# EAGLE design SAD_1_1 (EAGLE 8.3.2)
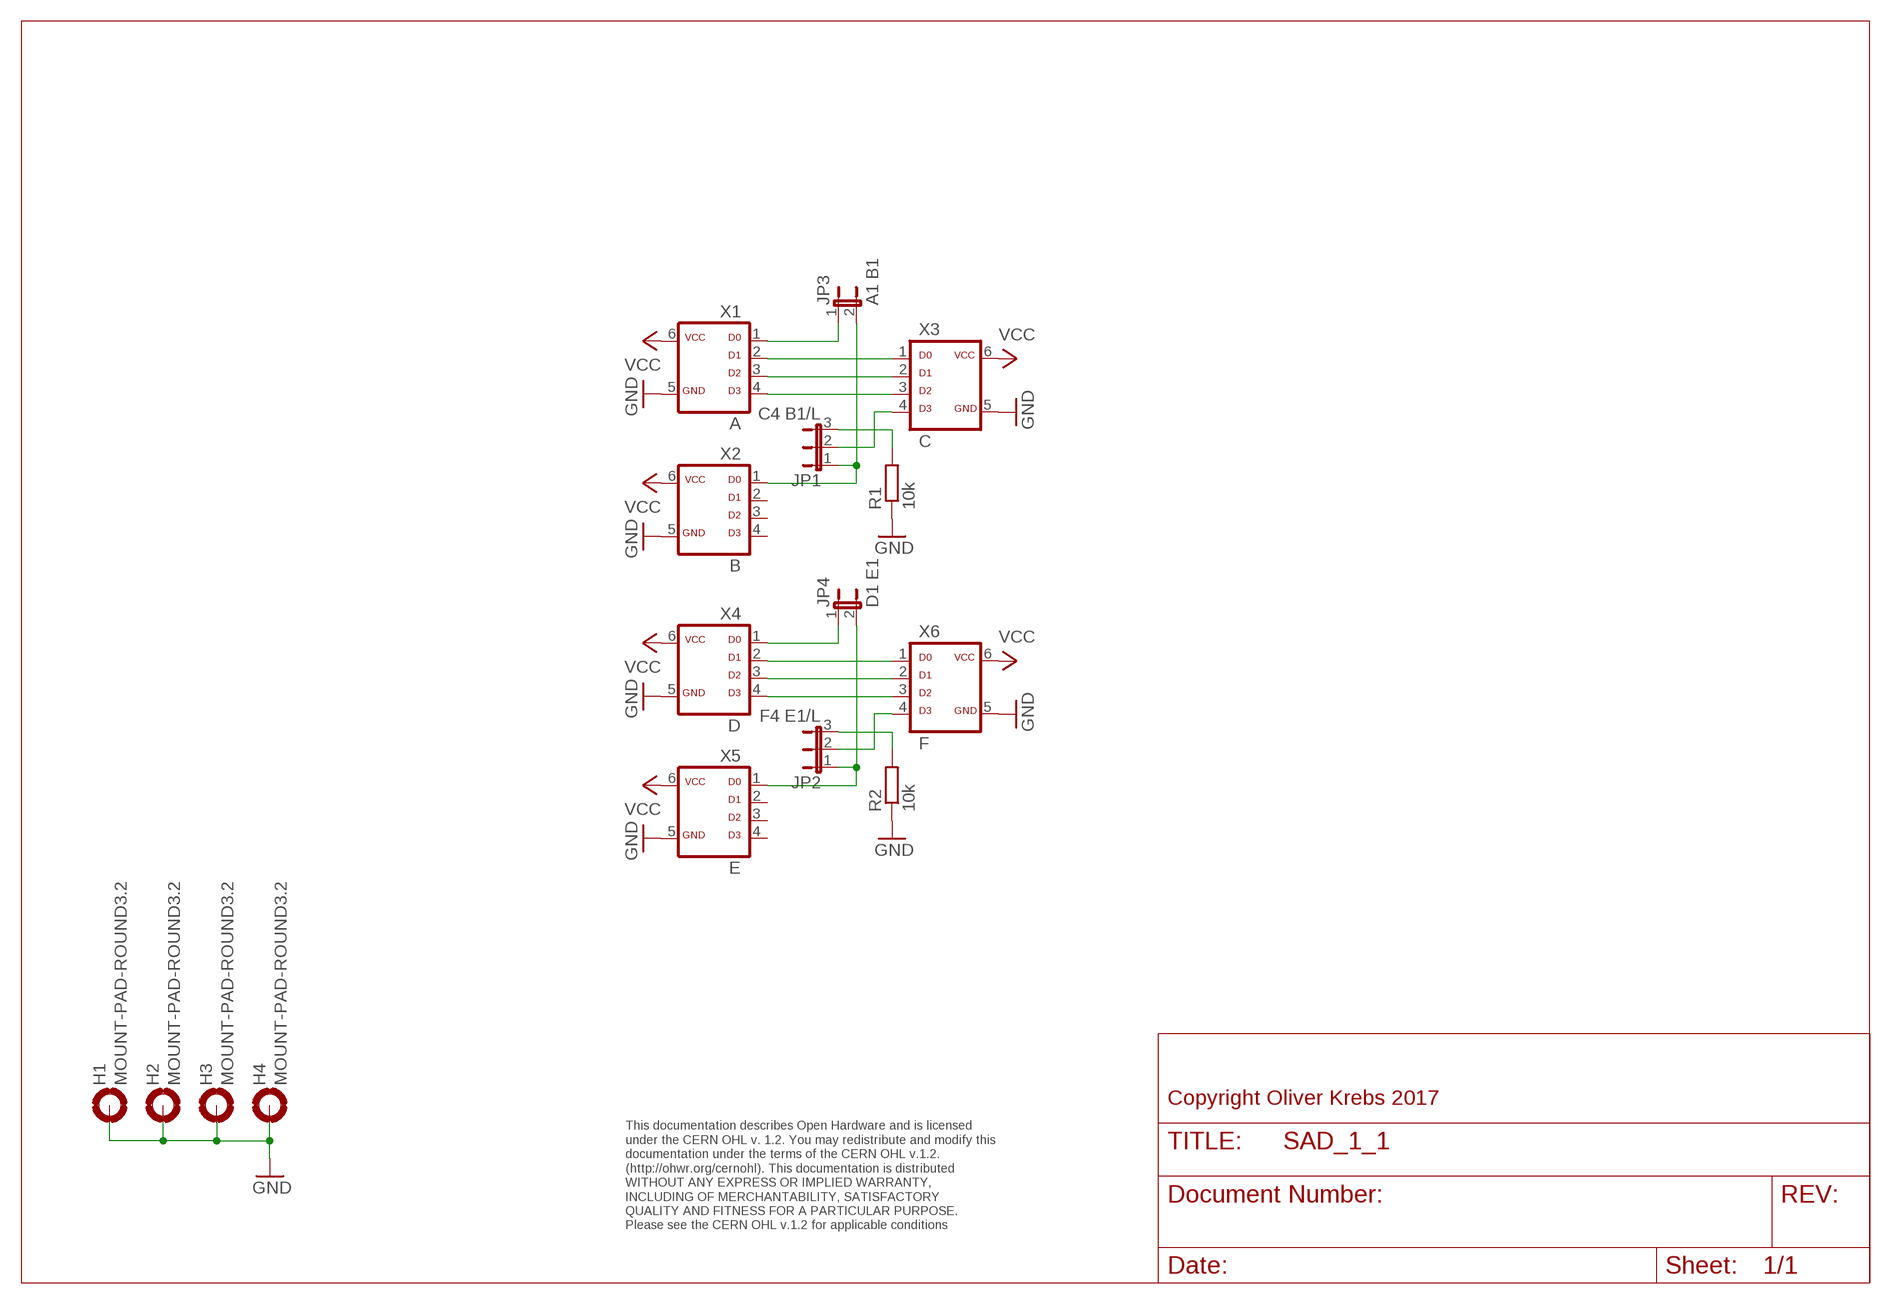
[diagram p0: schematic, sheet 1]

## Parts
H1  MOUNT-PAD-ROUND3.2  [3,2-PAD]
H2  MOUNT-PAD-ROUND3.2  [3,2-PAD]
H3  MOUNT-PAD-ROUND3.2  [3,2-PAD]
H4  MOUNT-PAD-ROUND3.2  [3,2-PAD]
JP1  C4 B1/L  JP2E  [JP2]
JP2  F4 E1/L  JP2E  [JP2]
JP3  A1 B1  JP1E  [JP1]
JP4  D1 E1  JP1E  [JP1]
R1  10k  R-EU_0207/10  [0207/10]
R2  10k  R-EU_0207/10  [0207/10]
X1  A  ML6D  [ML-6]
X2  B  ML6D  [ML-6]
X3  C  ML6D  [ML-6]
X4  D  ML6D  [ML-6]
X5  E  ML6D  [ML-6]
X6  F  ML6D  [ML-6]

## Nets
GND: H1.B3,2(MOUNT) H2.B3,2(MOUNT) H3.B3,2(MOUNT) H4.B3,2(MOUNT) R1.1 R2.1 X1.5 X2.5 X3.5 X4.5 X5.5 X6.5
N$1: X1.2 X3.1
N$2: X1.3 X3.2
N$3: X1.4 X3.3
N$4: JP1.2 X3.4
N$5: JP1.1 JP3.2 X2.1
N$6: JP4.1 X4.1
N$7: JP3.1 X1.1
N$8: JP1.3 R1.2
N$9: JP2.3 R2.2
N$10: X4.2 X6.1
N$11: X4.3 X6.2
N$12: X4.4 X6.3
N$13: JP2.2 X6.4
N$19: JP2.1 JP4.2 X5.1
VCC: X1.6 X2.6 X3.6 X4.6 X5.6 X6.6
Unconnected: X2.2 X2.3 X2.4 X5.2 X5.3 X5.4

## Notes on the sheet
- Copyright Oliver Krebs 2017
- This documentation describes Open Hardware and is licensed 
  under the CERN OHL v. 1.2. You may redistribute and modify this 
  documentation under the terms of the CERN OHL v.1.2. 
  (http://ohwr.org/cernohl). This documentation is distributed
  WITHOUT ANY EXPRESS OR IMPLIED WARRANTY, 
  INCLUDING OF MERCHANTABILITY, SATISFACTORY 
  QUALITY AND FITNESS FOR A PARTICULAR PURPOSE. 
  Please see the CERN OHL v.1.2 for applicable conditions

## Library data of the parts
H1-H4 = holes:MOUNT-PAD-ROUND: MOUNTING PAD, round
JP1 JP2 = jumper:JP2E: JUMPER
JP3 JP4 = jumper:JP1E: JUMPER
R1 R2 = 01-my_rcl:R-EU_: RESISTOR, European symbol
X1-X6 = 01-my-con:ML6D

## Board
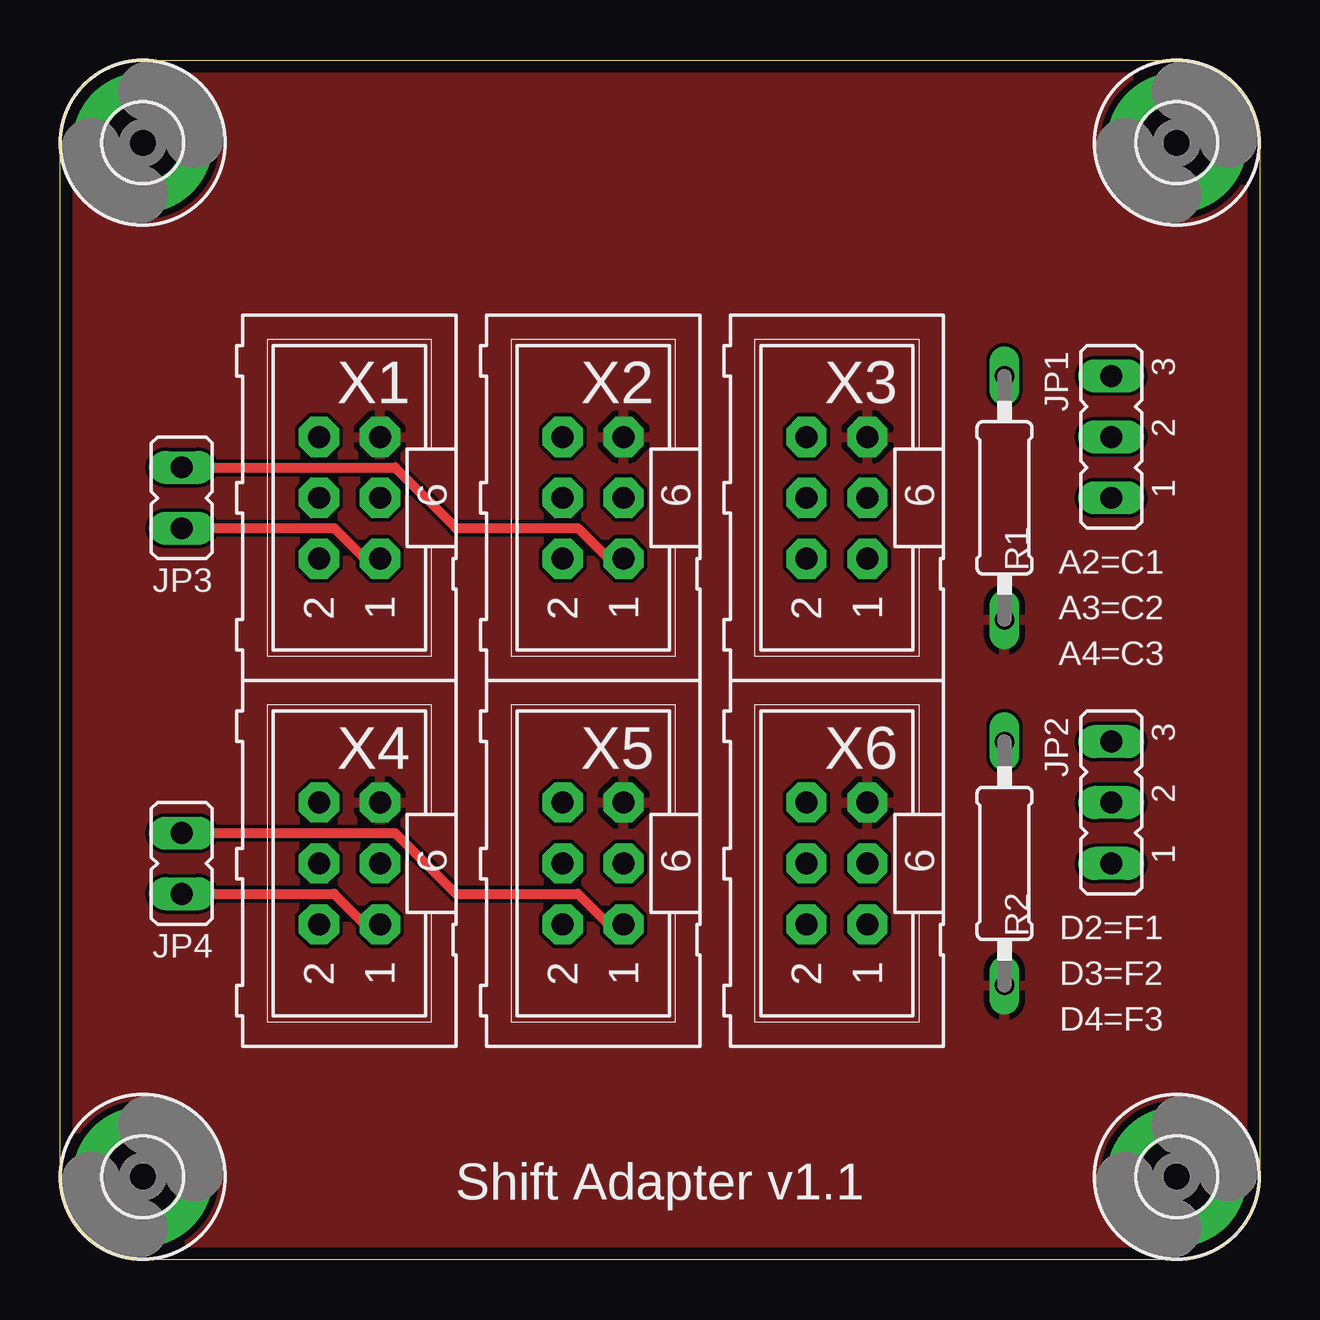
[diagram p1: board, top side]
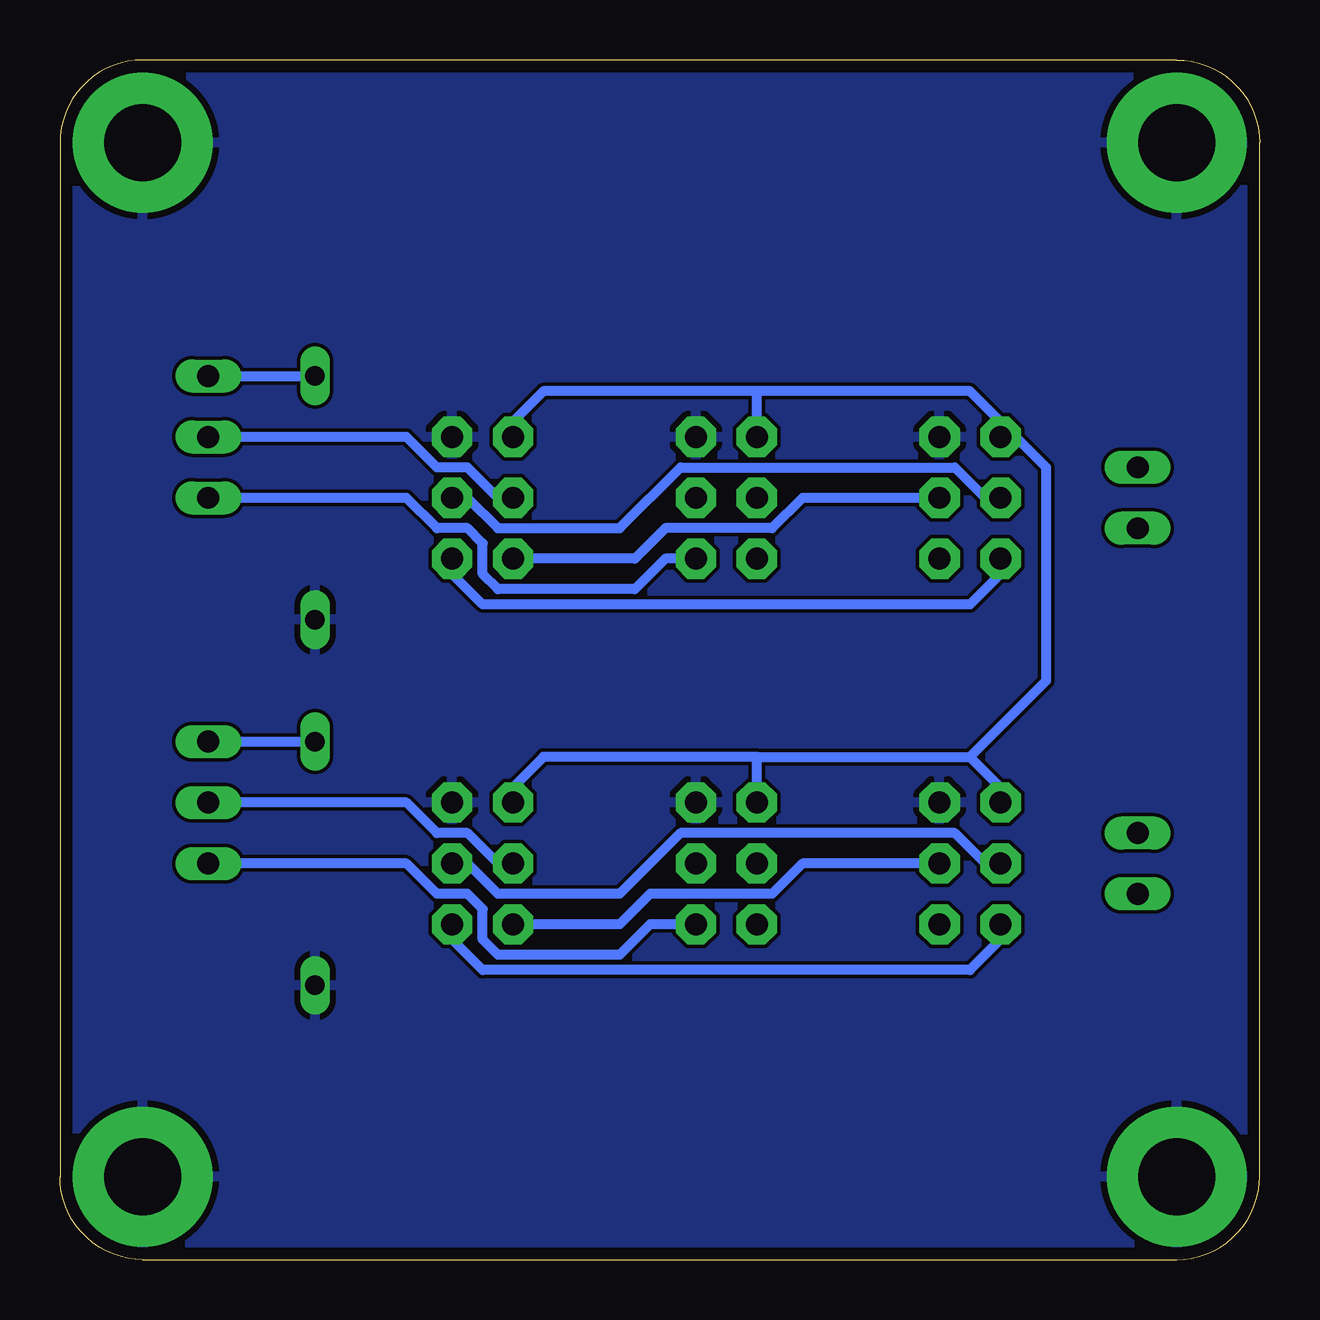
[diagram p2: board, bottom side, seen from below]

Size 50 x 50 mm. Coordinates in mm from the lower left corner, seen from the top.
Outline: 0,3.45 0,46.55 arc-90 3.45,50 46.55,50 arc-90 50,46.55 50,3.45 arc-90 46.55,0 3.45,0 arc-90 0,3.45
Copper layers (1*16): Top 0.035mm / dielectric 1.6mm / Bottom 0.035mm
Design rules "Elecrow_2-layer_PCB_eagle_rule": minimum track width 6mil, minimum drill 12mil, track to track 6mil, track to pad 6mil, pad to pad 6mil, via to via 8mil, smd to smd 0mil, copper to edge 20mil, drill to drill 10mil, minimum pad ring 6mil, minimum via ring 6mil, stop-mask expansion 0mil, vias tented up to drill 100mil, thermal gap 10mil

### Footprints (pad centres in the part's own frame; a part is rotated, then mirrored left to right if it is on the bottom)
3,2-PAD = drill 3.2 pad 5.842: B3,2 0,0
JP2 = drill 0.914 long: 1 -2.54,0; 2 0,0; 3 2.54,0
JP1 = drill 0.914 long: 1 0,-1.27; 2 0,1.27
0207/10 = drill 0.813 long: 1 -5.08,0; 2 5.08,0
ML-6 = drill 0.914 pad 1.676 octagon: 1 -2.54,-1.27; 2 -2.54,1.27; 3 0,-1.27; 4 0,1.27; 5 2.54,-1.27; 6 2.54,1.27

### Placement (x,y rotation side)
H1  3.45,3.45 0 top
H2  3.45,46.55 0 top
H3  46.55,46.55 0 top
H4  46.55,3.45 0 top
JP1  43.81,34.29 90 top
JP2  43.81,19.05 90 top
JP3  5.08,31.75 0 top
JP4  5.08,16.51 0 top
R1  39.37,31.75 90 top
R2  39.37,16.51 90 top
X1  12.06,31.75 90 top
X2  22.23,31.75 90 top
X3  32.38,31.75 90 top
X4  12.06,16.51 90 top
X5  22.23,16.51 90 top
X6  32.38,16.51 90 top

### Tracks (layer width: path | path; a pad name or v marks a point on that pad's centre or on a via)
GND
  pour Bottom: 0,0 50.8,0 50.8,50.8 0,50.8
  pour Top: 0,50.16 50.16,50.16 50.16,0 0,0
N$1
  Bottom 0.406: X1.2 10.79,28.57 12.06,27.3 32.38,27.3 33.66,28.57 X3.1
N$2
  Bottom 0.406: X1.3 19.05,31.75 20.32,30.48 24.77,30.48 26.04,29.21 X3.2
N$3
  Bottom 0.406: X3.3 33.02,31.75 31.75,30.48 26.67,30.48 24.13,33.02 12.7,33.02 11.43,31.75 X1.4
N$4
  Bottom 0.406: X3.4 31.75,31.75 33.02,33.02 34.29,33.02 35.56,34.29 JP1.2
N$5
  Top 0.406: JP3.2 13.97,33.02 16.51,30.48 21.59,30.48 22.86,29.21 X2.1
  Bottom 0.406: X2.1 24.77,29.21 26.04,27.94 31.75,27.94 32.38,28.57 32.38,29.84 33.02,30.48 34.29,30.48 35.56,31.75 JP1.1
N$6
  Top 0.406: JP4.1 11.43,15.24 12.7,13.97 X4.1
N$7
  Top 0.406: JP3.1 11.43,30.48 12.7,29.21 X1.1
N$8
  Bottom 0.406: JP1.3 R1.2
N$9
  Bottom 0.406: JP2.3 R2.2
N$10
  Bottom 0.406: X4.2 10.79,13.34 12.06,12.06 32.38,12.06 33.66,13.34 X6.1
N$11
  Bottom 0.406: X4.3 19.05,16.51 20.32,15.24 25.4,15.24 26.67,13.97 X6.2
N$12
  Bottom 0.406: X4.4 11.43,16.51 12.7,17.78 24.13,17.78 26.67,15.24 31.75,15.24 33.02,16.51 X6.3
N$13
  Bottom 0.406: X6.4 31.75,16.51 33.02,17.78 34.29,17.78 35.56,19.05 JP2.2
N$19
  Top 0.406: JP4.2 13.97,17.78 16.51,15.24 21.59,15.24 22.86,13.97 X5.1
  Bottom 0.406: X5.1 25.4,13.97 26.67,12.7 31.75,12.7 32.38,13.34 32.38,14.61 33.02,15.24 34.29,15.24 35.56,16.51 JP2.1
VCC
  Bottom 0.406: 10.16,34.29 12.06,36.2 20.95,36.2 | 20.95,36.2 29.84,36.2 31.11,34.92 X3.6 | X2.6 20.95,36.2 | X4.6 10.79,19.68 12.06,20.95 | 20.95,20.95 29.84,20.95 31.11,19.68 X6.6 | X5.6 20.95,20.95 | 20.95,20.95 12.06,20.95 | 12.06,20.95 8.89,24.13 8.89,33.02 10.16,34.29 | 10.16,34.29 X1.6

### Text on the board
tNames: A2=C1 | A3=C2 | A4=C3 | D2=F1 | D3=F2 | D4=F3 | Shift Adapter v1.1
200bmp: E:/Bilder/Elektronik/Modulion/Mexdulon/mexdulon_50x50_pcb.bmp